# Altium project IAS.PrjPCB
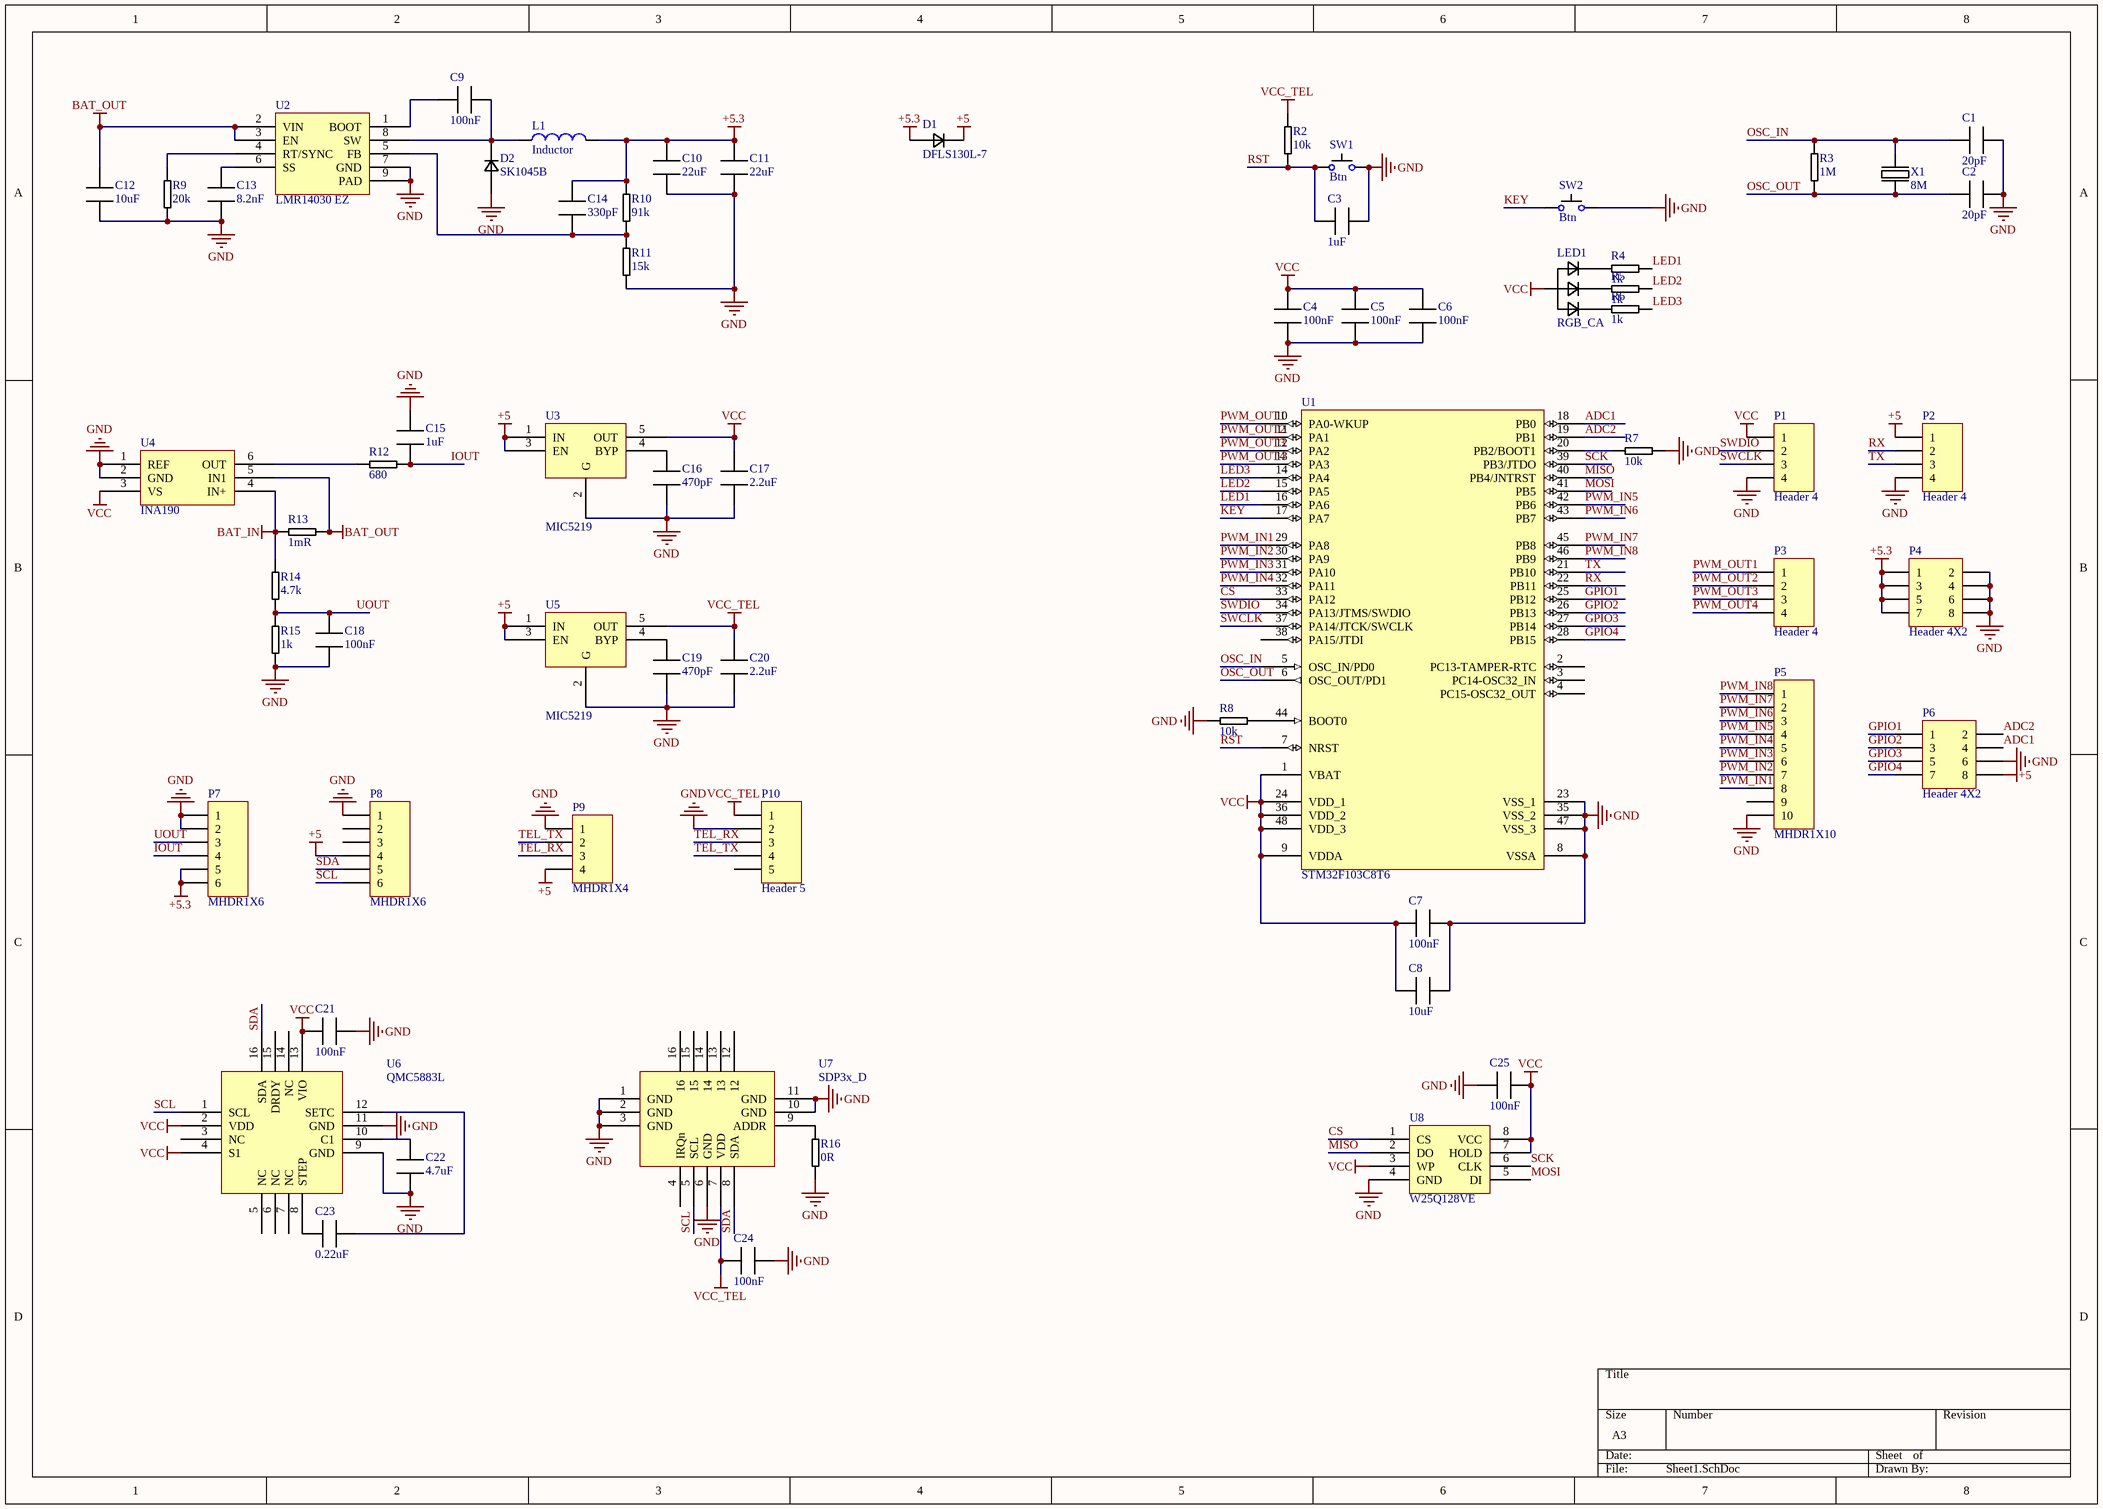
[diagram p0: Sheet1.SchDoc]
1 sheet, 65 parts. Net scope: global (net labels, ports and power ports of the same name join across sheets).
Board files: PCB1.PcbDoc, PCB2.PcbDoc

## Sheet Sheet1.SchDoc
size A3

### Parts
C1  20pF  [0603]
C2  20pF  [0603]
C3  1uF  [0603]
C4  100nF  [0603]
C5  100nF  [0603]
C6  100nF  [0603]
C7  100nF  [0603]
C8  10uF  [0603]
C9  100nF  [0603]
C10  22uF  [0603]
C11  22uF  [0603]
C12  10uF  [1210]
C13  8.2nF  [0603]
C14  330pF  [0603]
C15  1uF  [0603]
C16  470pF  [0603]
C17  2.2uF  [0603]
C18  100nF  [0603]
C19  470pF  [0603]
C20  2.2uF  [0603]
C21  100nF  [0603]
C22  4.7uF  [0603]
C23  0.22uF  [0603]
C24  100nF  [0603]
C25  100nF  [0603]
D1  DFLS130L-7  [PowerDI123]
D2  SK1045B  [SMB (DO-214AA)]
L1  Inductor  [Ind1040]
LED1  RGB_CA  [RGB1.6*1.6]
P1  Header 4  [HDR1X4]
P2  Header 4  [HDR1X4]
P3  Header 4  [HDR1X4]
P4  Header 4X2  [HDR2X4]
P5  MHDR1X10  [MHDR1X10]
P6  Header 4X2  [HDR2X4]
P7  MHDR1X6  [MHDR1X6]
P8  MHDR1X6  [MHDR1X6]
P9  MHDR1X4  [MHDR1X4]
P10  Header 5  [HDR1X5]
R2  10k  [0603]
R3  1M  [0603]
R4  1k  [0603]
R5  1k  [0603]
R6  1k  [0603]
R7  10k  [0603]
R8  10k  [0603]
R9  20k  [0603]
R10  91k  [0603]
R11  15k  [0603]
R12  680  [0603]
R13  1mR  [2512]
R14  4.7k  [0603]
R15  1k  [0603]
R16  0R  [0603]
SW1  Btn  [BTN_B3U_B]
SW2  Btn  [BTN_B3U_B]
U1  STM32F103C8T6  [LQFP48_N]
U2  LMR14030 EZ  [SOP8-Pad]
U3  MIC5219  [SOT23-5]
U4  INA190  [SC70]
U5  MIC5219  [SOT23-5]
U6  QMC5883L  [QMC5883]
U7  SDP3x_D  [SDP3x]
U8  W25Q128VE  [WSON8-8x6mm]
X1  8M  [XTAL-3225-4]

### Nets
+5: D1.2 P2.1 P6.8 P8.4 P9.4 U3.1(IN) U3.3(EN) U5.1(IN) U5.3(EN)
+5.3: C10.2 C11.2 C14.2 D1.1 L1.2 P4.1 P4.3 P4.5 P4.7 P7.5 P7.6 R10.2
BAT_IN: R13.1 R14.2 U4.4(IN+)
BAT_OUT: C12.2 R13.2 U2.2(VIN) U2.3(EN) U4.5(IN1)
GND: C1.2 C2.2 C3.2 C4.1 C5.1 C6.1 C7.2 C8.2 C10.1 C11.1 C12.1 C13.1 C15.2 C16.1 C17.1 C18.1 C19.1 C20.1 C21.2 C22.1 C24.2 C25.1 D2.1 P1.4 P2.4 P4.2 P4.4 P4.6 P4.8 P5.10 P6.6 P7.1 P7.2 P8.1 P9.1 P10.2 R7.2 R8.1 R9.1 R11.1 R15.1 R16.1 SW1.2 SW2.2 U1.8(VSSA) U1.23(VSS_1) U1.35(VSS_2) U1.47(VSS_3) U2.7(GND) U2.9(PAD) U3.2(G) U4.1(REF) U4.2(GND) U5.2(G) U6.9(GND) U6.11(GND) U7.1(GND) U7.2(GND) U7.3(GND) U7.6(GND) U7.10(GND) U7.11(GND) U8.4(GND)
VCC: C4.2 C5.2 C6.2 C7.1 C8.1 C17.2 C21.1 C25.2 LED1.4 P1.1 U1.1(VBAT) U1.9(VDDA) U1.24(VDD_1) U1.36(VDD_2) U1.48(VDD_3) U3.5(OUT) U4.3(VS) U6.2(VDD) U6.4(S1) U6.13(VIO) U8.3(WP) U8.7(HOLD) U8.8(VCC)
VCC_TEL: C20.2 C24.1 P10.1 R2.2 U5.5(OUT) U7.7(VDD)
ADC1: P6.4 U1.18(PB0)
ADC2: P6.2 U1.19(PB1)
CS: U1.33(PA12) U8.1(CS)
GPIO1: P6.1 U1.25(PB12)
GPIO2: P6.3 U1.26(PB13)
GPIO3: P6.5 U1.27(PB14)
GPIO4: P6.7 U1.28(PB15)
IOUT: C15.1 P7.4 R12.2
KEY: SW2.1 U1.17(PA7)
LED1: R4.2 U1.16(PA6)
LED2: R5.2 U1.15(PA5)
LED3: R6.2 U1.14(PA4)
MISO: U1.40(PB4/JNTRST) U8.2(DO)
MOSI: U1.41(PB5) U8.5(DI)
OSC_IN: C1.1 R3.2 U1.5(OSC_IN/PD0) X1.2
OSC_OUT: C2.1 R3.1 U1.6(OSC_OUT/PD1) X1.1
PWM_IN1: P5.8 U1.29(PA8)
PWM_IN2: P5.7 U1.30(PA9)
PWM_IN3: P5.6 U1.31(PA10)
PWM_IN4: P5.5 U1.32(PA11)
PWM_IN5: P5.4 U1.42(PB6)
PWM_IN6: P5.3 U1.43(PB7)
PWM_IN7: P5.2 U1.45(PB8)
PWM_IN8: P5.1 U1.46(PB9)
PWM_OUT1: P3.1 U1.10(PA0-WKUP)
PWM_OUT2: P3.2 U1.11(PA1)
PWM_OUT3: P3.3 U1.12(PA2)
PWM_OUT4: P3.4 U1.13(PA3)
RST: C3.1 R2.1 SW1.1 U1.7(NRST)
RX: P2.2 U1.22(PB11)
SCK: U1.39(PB3/JTDO) U8.6(CLK)
SCL: P8.6 U6.1(SCL) U7.5(SCL)
SDA: P8.5 U6.16(SDA) U7.8(SDA)
SWCLK: P1.3 U1.37(PA14/JTCK/SWCLK)
SWDIO: P1.2 U1.34(PA13/JTMS/SWDIO)
TEL_RX: P9.3 P10.3
TEL_TX: P9.2 P10.4
TX: P2.3 U1.21(PB10)
UOUT: C18.2 P7.3 R14.1 R15.2
NetC9_1: C9.1 U2.1(BOOT)
NetC9_2: C9.2 D2.2 L1.1 U2.8(SW)
NetC13_2: C13.2 U2.6(SS)
NetC14_1: C14.1 R10.1 R11.2 U2.5(FB)
NetC16_2: C16.2 U3.4(BYP)
NetC19_2: C19.2 U5.4(BYP)
NetC22_2: C22.2 U6.10(C1)
NetC23_1: C23.1 U6.8(STEP)
NetC23_2: C23.2 U6.12(SETC)
NetLED1_1: LED1.1 R4.1
NetLED1_2: LED1.2 R5.1
NetLED1_3: LED1.3 R6.1
NetR7_1: R7.1 U1.20(PB2/BOOT1)
NetR8_2: R8.2 U1.44(BOOT0)
NetR9_2: R9.2 U2.4(RT/SYNC)
NetR12_1: R12.1 U4.6(OUT)
NetR16_2: R16.2 U7.9(ADDR)

Not connected (* = marked no-connect by the designer): P5 9; P8 2 3; P10 5; U1 2(PC13-TAMPER-RTC) 3(PC14-OSC32_IN) 4(PC15-OSC32_OUT) 38(PA15/JTDI); U6 3(NC) 5(NC) 6(NC) 7(NC) 14(NC) 15(DRDY); U7 4(IRQn) 12 13 14 15 16

### Notes on the sheet
- (in symbol BAT) +

### Library data of the parts
C1-C25 = Cap
D1 D2 = Diode
P1-P3 = Header 4: Header, 4-Pin; LatestRevisionDate: 17-Jul-2002; LatestRevisionNote: Re-released for DXP Platform.; Publisher: Altium Limited
P4 P6 = Header 4X2: Header, 4-Pin, Dual row; LatestRevisionDate: 17-Jul-2002; LatestRevisionNote: Re-released for DXP Platform.; Publisher: Altium Limited
P5 = MHDR1X10: Header, 10-Pin; LatestRevisionDate: 17-Jul-2002; LatestRevisionNote: Re-released for DXP Platform.; Publisher: Altium Limited
P7 P8 = MHDR1X6: Header, 6-Pin; LatestRevisionDate: 17-Jul-2002; LatestRevisionNote: Re-released for DXP Platform.; Publisher: Altium Limited
P9 = MHDR1X4: Header, 4-Pin; LatestRevisionDate: 17-Jul-2002; LatestRevisionNote: Re-released for DXP Platform.; Publisher: Altium Limited
P10 = Header 5: Header, 5-Pin; LatestRevisionDate: 17-Jul-2002; LatestRevisionNote: Re-released for DXP Platform.; Publisher: Altium Limited
R2-R16 = Res
U1 = STM32F103C8T6: STM32 ARM-based 32-bit MCU with 64 Kbytes Flash, 48-pin LQFP, Industrial Temperature; Published: 30-May-2008; DatasheetVersion: rev6, Mar-2008; PackageVersion: Mar-2008; PackageReference: LQFP48; Publisher: Altium Limited; PackageDescription: 48-Pin Low-Profile Quad Flat Pack, 7 x 7 mm Body, 0.5 mm Pitch (LQFP48); ComponentLink1Description: Manufacturer Link; ComponentLink1URL: www.st.com/stm32; ComponentLink2Description: Datasheet; ComponentLink2URL: http://www.st.com/stonline/products/literature/ds/13587.pdf
U8 = W25QxxxVE/A
X1 = XTAL